# Altium schematic sheet CCU_mcu.SchDoc
size A4
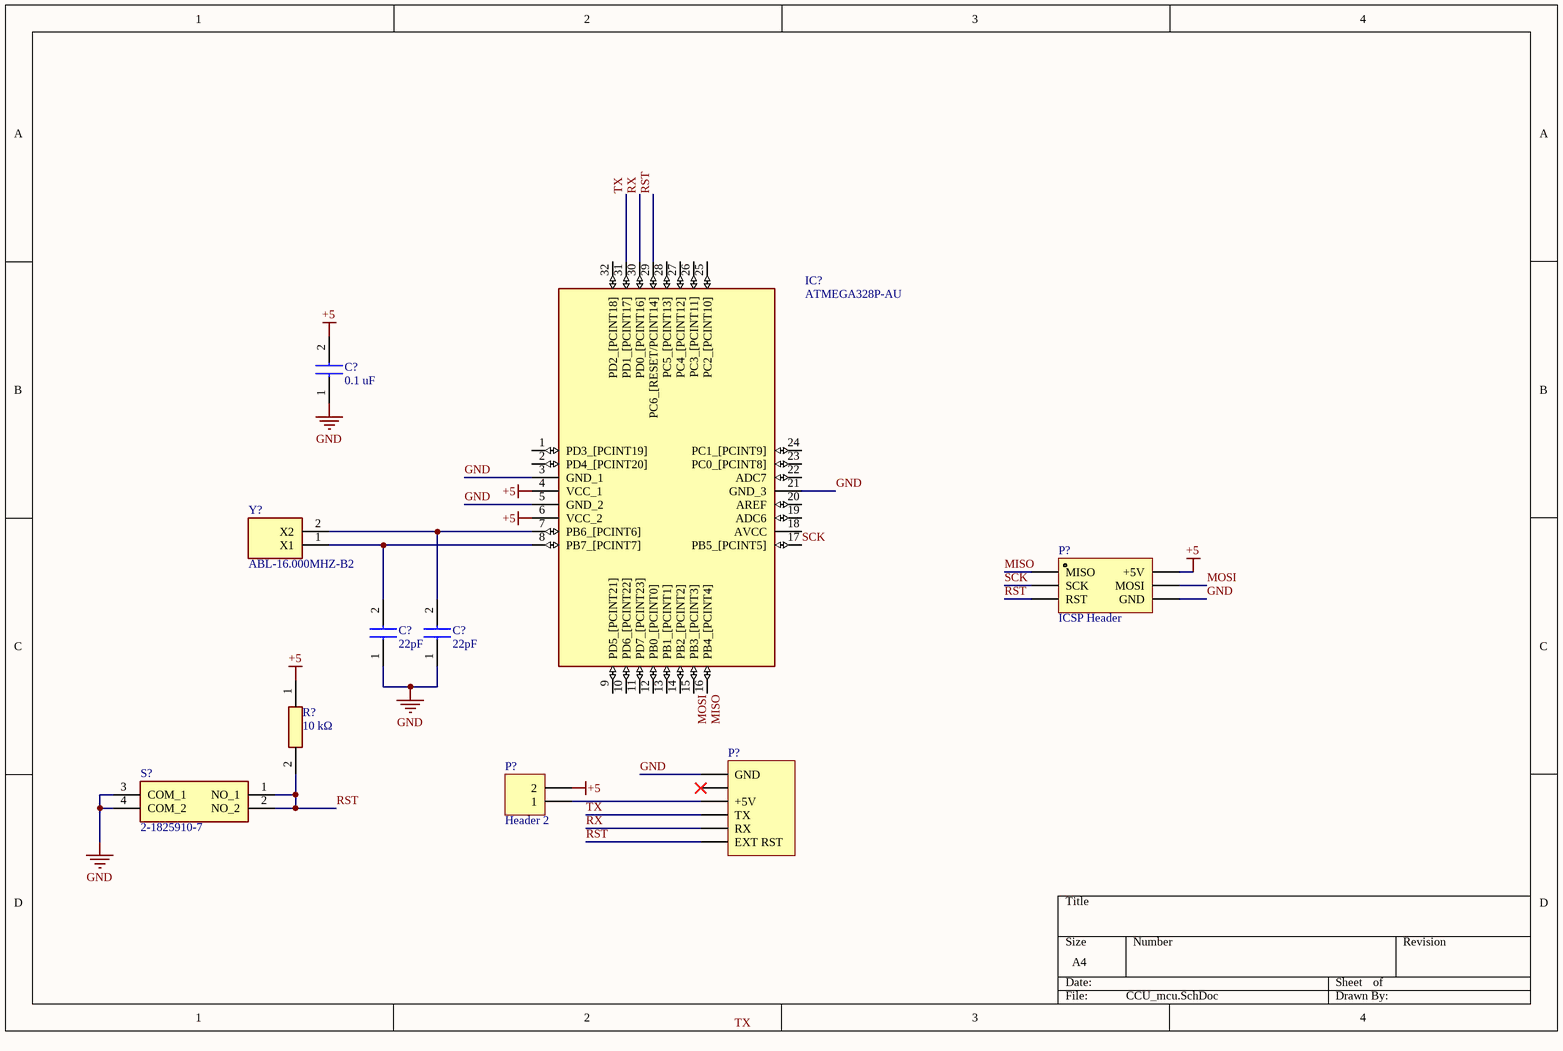
[diagram p0: CCU_mcu.SchDoc]

## Parts
(Parts that share a designator on the sheet are numbered #1, #2 ... from top to bottom, then left to right.)
C?#1  0.1 uF  [CAPC0603X33N]
C?#2  22pF  [CAPC2012X90N]
C?#3  22pF  [CAPC2012X90N]
IC?  ATMEGA328P-AU  [QFP80P900X900X120-32N]
P?#1  ICSP Header  [HDR2X3]
P?#2  Arduino  [HDR1X6]  (value not drawn)
P?#3  Header 2  [HDR1X2]
R?  10 kΩ  [RESC3216X60N]
S?  2-1825910-7  [218259107]
Y?  ABL-16.000MHZ-B2  [ABL16000MHZB2]

## Nets
+5: C?#1.2 IC?.4(VCC_1) IC?.6(VCC_2) P?#1.2(+5V) P?#3.2 R?.1
GND: C?#1.1 C?#2.1 C?#3.1 IC?.3(GND_1) IC?.5(GND_2) IC?.21(GND_3) P?#1.6(GND) P?#2.1(GND) S?.3(COM_1) S?.4(COM_2)
MISO: IC?.16(PB4_[PCINT4]) P?#1.1(MISO)
MOSI: IC?.15(PB3_[PCINT3]) P?#1.4(MOSI)
RST: IC?.29(PC6_[RESET/PCINT14]) P?#1.5(RST) P?#2.6(EXT_RST) R?.2 S?.1(NO_1) S?.2(NO_2)
RX: IC?.30(PD0_[PCINT16]) P?#2.5(RX)
SCK: IC?.17(PB5_[PCINT5]) P?#1.3(SCK)
TX: IC?.31(PD1_[PCINT17]) P?#2.4(TX)
NetC?#2_2: C?#2.2 IC?.8(PB7_[PCINT7]) Y?.1(X1)
NetC?#3_2: C?#3.2 IC?.7(PB6_[PCINT6]) Y?.2(X2)
NetP?#2_3: P?#2.3(+5V) P?#3.1

Not connected (* = marked no-connect by the designer): IC? 1(PD3_[PCINT19]) 2(PD4_[PCINT20]) 9(PD5_[PCINT21]) 10(PD6_[PCINT22]) 11(PD7_[PCINT23]) 12(PB0_[PCINT0]) 13(PB1_[PCINT1]) 14(PB2_[PCINT2]) 18(AVCC) 19(ADC6) 20(AREF) 22(ADC7) 23(PC0_[PCINT8]) 24(PC1_[PCINT9]) 25(PC2_[PCINT10]) 26(PC3_[PCINT11]) 27(PC4_[PCINT12]) 28(PC5_[PCINT13]) 32(PD2_[PCINT18]); P?#2 2*

## Notes on the sheet
- Labels drawn without touching a wire or pin: TX

## Library data of the parts
C?#1 = 02016D104KAT2A: Capacitor; Manufacturer_Name: AVX; Datasheet Link: http://www.mouser.com/catalog/supplier/library/pdf/AVXSurfaceMountCeramic.pdf; Height: 0.33mm; Manufacturer_Part_Number: 02016D104KAT2A; Mouser Part Number: 581-02016D104KAT2A; Mouser Price/Stock: https://www.mouser.co.uk/ProductDetail/AVX/02016D104KAT2A/?qs=PN7sAUOUrntlfwxbZzo6OQ%3D%3D; Arrow Part Number: 02016D104KAT2A; Arrow Price/Stock: https://www.arrow.com/en/products/02016d104kat2a/avx; Value: 0.1 uF
C?#2 C?#3 = C0805C220F5GACTU: Capacitor; Manufacturer_Name: Kemet; Datasheet Link: https://componentsearchengine.com/Datasheets/1/C0805C220F5GACTU.pdf; Height: 0.9mm; Manufacturer_Part_Number: C0805C220F5GACTU; Mouser Part Number: 80-C0805C220F5G; Mouser Price/Stock: https://www.mouser.co.uk/ProductDetail/KEMET/C0805C220F5GACTU/?qs=RXK%252BYb%252BisXRjMukjg6azjA%3D%3D; Arrow Part Number: C0805C220F5GACTU; Arrow Price/Stock: https://www.arrow.com/en/products/c0805c220f5gactu/kemet-corporation; Value: 22pF
IC? = ATMEGA328P-AU: Integrated Circuit; Manufacturer_Name: Microchip; Datasheet Link: https://componentsearchengine.com/Datasheets/2/ATMEGA328P-AU.pdf; Height: 1.2mm; Manufacturer_Part_Number: ATMEGA328P-AU; Mouser Part Number: 556-ATMEGA328P-AU; Mouser Price/Stock: https://www.mouser.co.uk/ProductDetail/Microchip-Technology-Atmel/ATMEGA328P-AU/?qs=K8BHR703ZXiCmmgp6%2FGNmQ%3D%3D; Arrow Part Number: ATMEGA328P-AU; Arrow Price/Stock: https://www.arrow.com/en/products/atmega328p-au/microchip-technology
P?#1 = ICSP Header 3X2: Header, 3-Pin, Dual row
P?#2 = USB2SERIAL: Header, 6-Pin; Publisher: Altium Limited
P?#3 = Header 2: Header, 2-Pin; LatestRevisionDate: 17-Jul-2002; LatestRevisionNote: Re-released for DXP Platform.; Publisher: Altium Limited
R? = CRCW120610K0FKEAC: Resistor; Manufacturer_Name: Vishay; Datasheet Link: http://componentsearchengine.com/Datasheets/1/CRCW120610K0FKEAC.pdf; Height: 0.6mm; Manufacturer_Part_Number: CRCW120610K0FKEAC; Mouser Part Number: 71-CRCW120610K0FKEAC; Mouser Price/Stock: https://www.mouser.co.uk/ProductDetail/Vishay-Dale/CRCW120610K0FKEAC/?qs=E3Y5ESvWgWNPpaQJSBoFjw%3D%3D; Arrow Part Number: CRCW120610K0FKEAC; Arrow Price/Stock: https://www.arrow.com/en/products/crcw120610k0fkeac/vishay; Value: 10 kΩ
S? = 2-1825910-7: Switch; Manufacturer_Name: TE Connectivity; Datasheet Link: http://www.te.com/commerce/DocumentDelivery/DDEController?Action=showdoc&DocId=Customer+Drawing%7F1825910%7FC10%7Fpdf%7FEnglish%7FENG_CD_1825910_C10.pdf%7F2-1825910-7; Height: 13mm; Manufacturer_Part_Number: 2-1825910-7; Mouser Part Number: 506-2-1825910-7; Mouser Price/Stock: https://www.mouser.co.uk/ProductDetail/TE-Connectivity-PB/2-1825910-7/?qs=epcAG6di8szpGFLvuwXKeQ%3D%3D; Arrow Part Number: 2-1825910-7; Arrow Price/Stock: https://www.arrow.com/en/products/2-1825910-7/te-connectivity
Y? = ABL-16.000MHZ-B2: Crystal or Oscillator; Manufacturer_Name: ABRACON; Datasheet Link: http://www.abracon.com/Resonators/ABL.pdf; Height: 3.5mm; Manufacturer_Part_Number: ABL-16.000MHZ-B2; Mouser Part Number: 815-ABL-16-B2; Mouser Price/Stock: https://www.mouser.co.uk/ProductDetail/ABRACON/ABL-16000MHZ-B2?qs=A7YjigRBFZlH19Ss3q%252BAbA%3D%3D; Arrow Part Number: ABL-16.000MHZ-B2; Arrow Price/Stock: https://www.arrow.com/en/products/abl-16.000mhz-b2/abracon